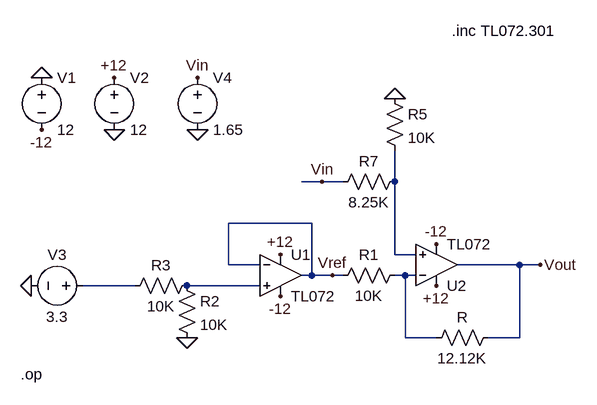
[diagram p0: schematic DAC_Offset_DC_OP_PNT_2.asc]
DAC_Offset_DC_OP_PNT_2.asc, the LTspice schematic file:
Version 4.1
SHEET 1 880 680
WIRE 160 272 128 272
WIRE 192 272 160 272
WIRE 272 272 272 224
WIRE 144 336 16 336
WIRE 272 384 272 272
WIRE 304 384 272 384
WIRE 16 400 16 336
WIRE 64 400 16 400
WIRE 464 400 368 400
WIRE 496 400 464 400
WIRE 144 416 144 336
WIRE 144 416 128 416
WIRE 176 416 144 416
WIRE 192 416 176 416
WIRE 288 416 272 416
WIRE 304 416 288 416
WIRE -128 432 -208 432
WIRE 64 432 -48 432
WIRE 288 512 288 416
WIRE 336 512 288 512
WIRE 464 512 464 400
WIRE 464 512 416 512
FLAG -48 512 0
FLAG 496 400 Vout
FLAG 272 144 0
FLAG 160 272 Vin
FLAG -160 192 0
FLAG -272 112 0
FLAG -160 112 +12
FLAG -272 192 -12
FLAG 96 448 -12
FLAG 336 368 -12
FLAG 336 432 +12
FLAG 96 384 +12
FLAG -288 432 0
FLAG -32 112 Vin
FLAG -32 192 0
FLAG 176 416 Vref
SYMBOL OpAmps\\opamp2 96 352 R0
SYMATTR InstName U1
SYMATTR Value TL072
SYMBOL res 288 400 R90
WINDOW 0 0 56 VBottom 2
WINDOW 3 32 56 VTop 2
SYMATTR InstName R1
SYMATTR Value 10K
SYMBOL res -64 416 R0
SYMATTR InstName R2
SYMATTR Value 10K
SYMBOL res -32 416 R90
WINDOW 0 0 56 VBottom 2
WINDOW 3 32 56 VTop 2
SYMATTR InstName R3
SYMATTR Value 10K
SYMBOL OpAmps\\opamp2 336 464 M180
SYMATTR InstName U2
SYMATTR Value TL072
SYMBOL res 432 496 R90
WINDOW 0 0 56 VBottom 2
WINDOW 3 32 56 VTop 2
SYMATTR InstName R
SYMATTR Value 12.12K
SYMBOL res 256 128 R0
SYMATTR InstName R5
SYMATTR Value 10K
SYMBOL res 288 256 R90
WINDOW 0 0 56 VBottom 2
WINDOW 3 32 56 VTop 2
SYMATTR InstName R7
SYMATTR Value 8.25K
SYMBOL voltage -272 96 R0
WINDOW 123 0 0 Left 0
WINDOW 39 0 0 Left 0
SYMATTR InstName V1
SYMATTR Value 12
SYMBOL voltage -160 96 R0
WINDOW 123 0 0 Left 0
WINDOW 39 0 0 Left 0
SYMATTR InstName V2
SYMATTR Value 12
SYMBOL voltage -192 432 R90
WINDOW 0 -32 56 VBottom 2
WINDOW 3 32 56 VTop 2
WINDOW 123 0 0 Left 0
WINDOW 39 0 0 Left 0
SYMATTR InstName V3
SYMATTR Value 3.3
SYMBOL voltage -32 96 R0
WINDOW 123 0 0 Left 0
WINDOW 39 0 0 Left 0
SYMATTR InstName V4
SYMATTR Value 1.65
TEXT 360 40 Left 2 !.inc TL072.301
TEXT -304 568 Left 2 !.op

The netlist it stands for:
* DAC_Offset_DC_OP_PNT_2.asc
X§U1 N004 Vref +12 -12 Vref TL072  ; pins In+ In- V+ V- OUT
R1 N002 Vref 10K
R2 N004 0 10K
R3 N004 N003 10K
X§U2 N001 N002 +12 -12 Vout TL072  ; pins In+ In- V+ V- OUT
R Vout N002 12.12K
R5 0 N001 10K
R7 N001 Vin 8.25K
V1 0 -12 12
V2 +12 0 12
V3 N003 0 3.3
V4 Vin 0 1.65
.inc TL072.301
.op
.backanno
.end